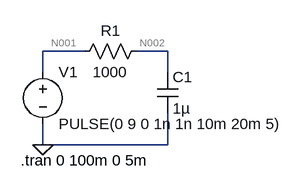
[diagram p0: schematic q1.asc]
q1.asc, the LTspice schematic file:
Version 4
SHEET 1 880 680
WIRE 128 128 64 128
WIRE 256 128 208 128
WIRE 64 160 64 128
WIRE 256 160 256 128
WIRE 64 272 64 240
WIRE 256 272 256 224
WIRE 256 272 64 272
FLAG 64 272 0
SYMBOL res 224 112 R90
WINDOW 0 0 56 VBottom 2
WINDOW 3 32 56 VTop 2
SYMATTR InstName R1
SYMATTR Value 1000
SYMBOL cap 240 160 R0
SYMATTR InstName C1
SYMATTR Value 1µ
SYMBOL voltage 64 144 R0
WINDOW 123 0 0 Left 2
WINDOW 39 0 0 Left 2
SYMATTR InstName V1
SYMATTR Value PULSE(0 9 0 1n 1n 10m 20m 5)
TEXT 30 296 Left 2 !.tran 0 100m 0 5m

The netlist it stands for:
* q1.asc
R1 N002 N001 1000
C1 N002 0 1µ
V1 N001 0 PULSE(0 9 0 1n 1n 10m 20m 5)
.tran 0 100m 0 5m
.backanno
.end

* Results of the author's LTspice run, read from the files saved beside the schematic
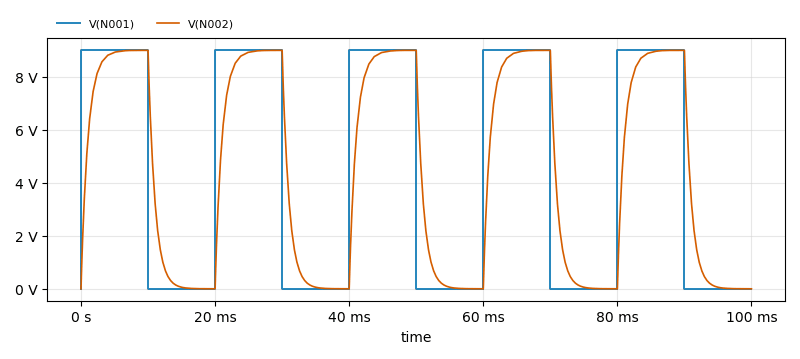
[diagram p1: Transient Analysis of q1.asc, plotted from the saved traces]
* Transient Analysis, 1 run:
*   V(N001): min 0 V, max 9 V, average 4.5 V, rms 6.364 V, last 0 V
*   V(N002): min 0 V, max 9 V, average 4.49 V, rms 6.026 V, last 364.4 µV